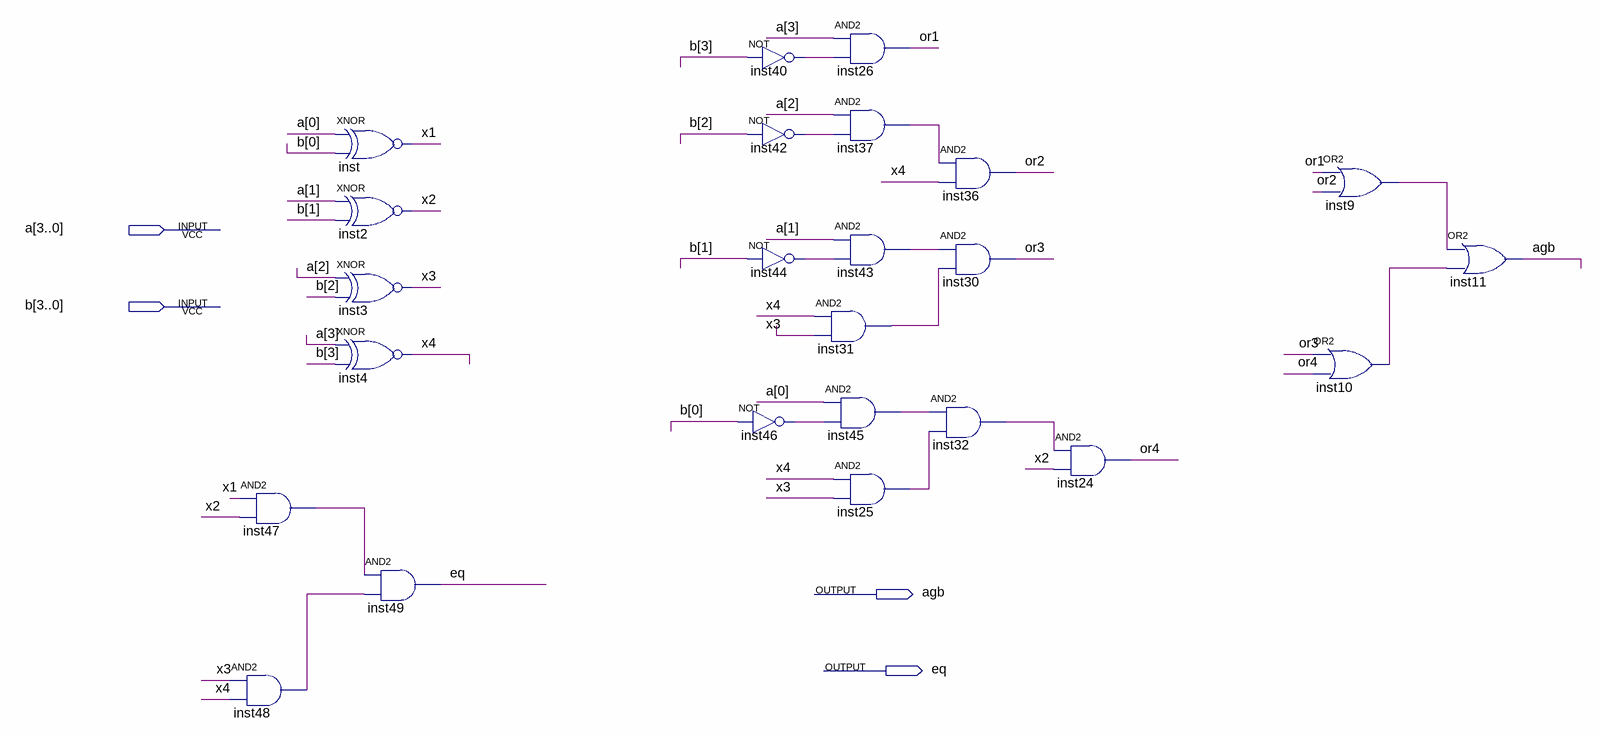
[diagram p0: schematic sheet]
// Quartus schematic agb_4bit.bdf as structural Verilog: 24 symbols, 4 pins
module agb_4bit (
  input  [3:0] a,
  input  [3:0] b,
  output agb,
  output eq
);

  wire inst9_out, inst10_out, inst25_out, inst31_out, inst32_out, inst37_out, inst40_out, inst42_out,
       inst43_out, inst44_out, inst45_out, inst46_out, inst47_out, inst48_out, or1, or2, or3, or4, x1, x2,
       x3, x4;

  and inst47 (inst47_out, x1, x2);
  and inst48 (inst48_out, x3, x4);
  xnor inst (x1, a[0], b[0]);
  xnor inst2 (x2, a[1], b[1]);
  xnor inst3 (x3, a[2], b[2]);
  xnor inst4 (x4, a[3], b[3]);
  and inst49 (eq, inst47_out, inst48_out);
  not inst40 (inst40_out, b[3]);
  not inst42 (inst42_out, b[2]);
  not inst44 (inst44_out, b[1]);
  not inst46 (inst46_out, b[0]);
  and inst26 (or1, a[3], inst40_out);
  and inst37 (inst37_out, a[2], inst42_out);
  and inst43 (inst43_out, a[1], inst44_out);
  and inst31 (inst31_out, x4, x3);
  and inst45 (inst45_out, a[0], inst46_out);
  and inst25 (inst25_out, x4, x3);
  and inst36 (or2, inst37_out, x4);
  and inst30 (or3, inst43_out, inst31_out);
  and inst32 (inst32_out, inst45_out, inst25_out);
  and inst24 (or4, inst32_out, x2);
  or inst9 (inst9_out, or1, or2);
  or inst10 (inst10_out, or3, or4);
  or inst11 (agb, inst9_out, inst10_out);
endmodule
